# EAGLE schematic PQ60 EPS FV3 (EAGLE 7.4.0)
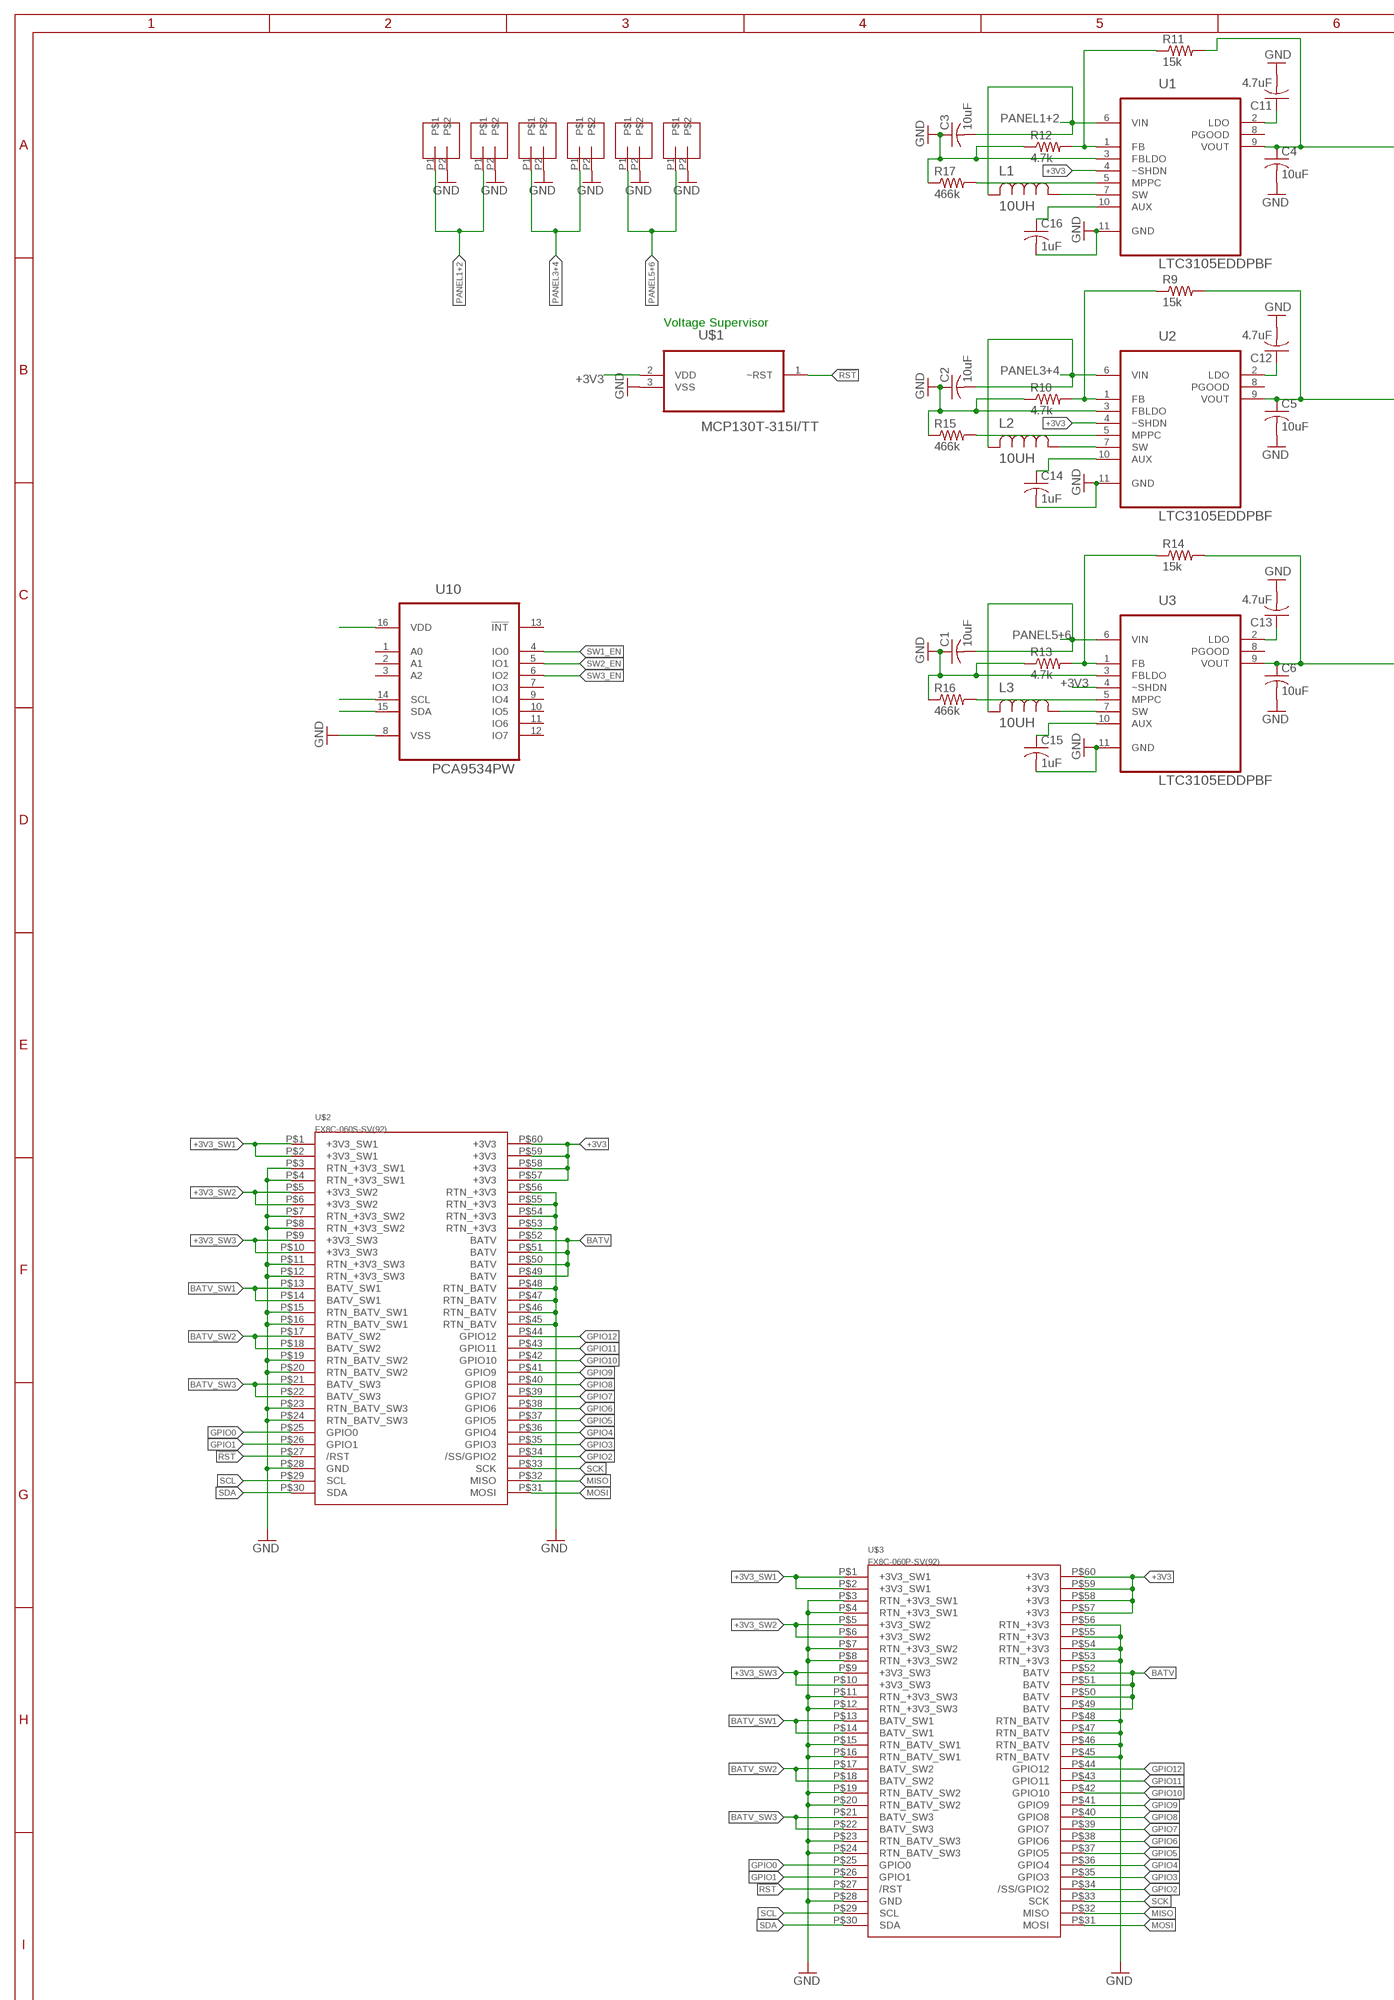
[diagram p0: schematic, sheet 1, part 1 of 2]
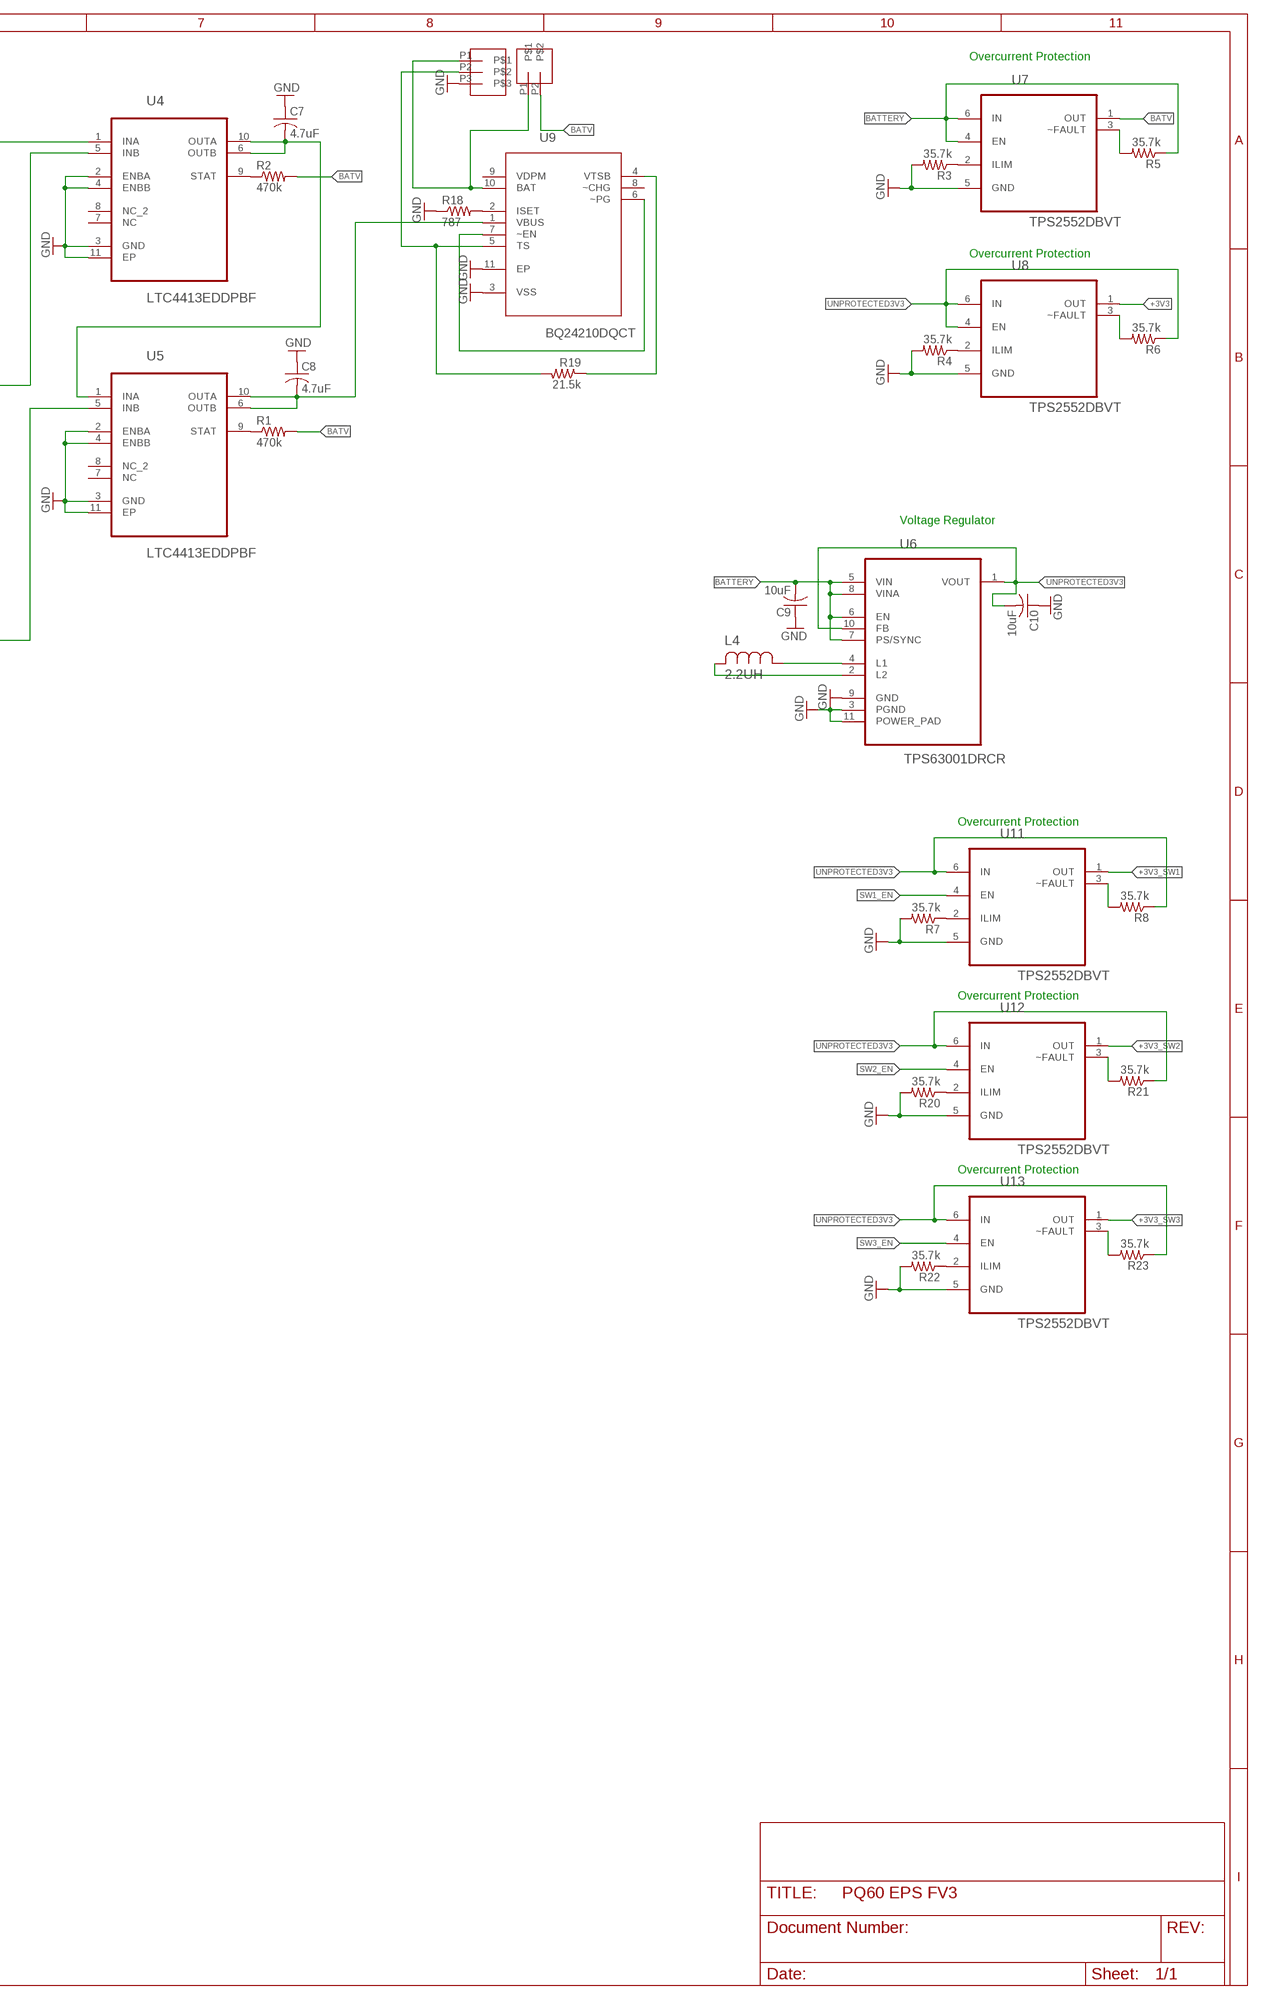
[diagram p1: schematic, sheet 1, part 2 of 2]

## Parts
C1  10uF  C-USC0805  [C0805]
C2  10uF  C-USC0805  [C0805]
C3  10uF  C-USC0805  [C0805]
C4  10uF  C-USC0805  [C0805]
C5  10uF  C-USC0805  [C0805]
C6  10uF  C-USC0805  [C0805]
C7  4.7uF  C-USC0805  [C0805]
C8  4.7uF  C-USC0805  [C0805]
C9  10uF  C-USC0805  [C0805]
C10  10uF  C-USC0805  [C0805]
C11  4.7uF  C-USC0805  [C0805]
C12  4.7uF  C-USC0805  [C0805]
C13  4.7uF  C-USC0805  [C0805]
C14  1uF  C-USC0805  [C0805]
C15  1uF  C-USC0805  [C0805]
C16  1uF  C-USC0805  [C0805]
L1  10UH  ELL6SH100M-6XH  [IND_ELL6XH]
L2  10UH  ELL6SH100M-6XH  [IND_ELL6XH]
L3  10UH  ELL6SH100M-6XH  [IND_ELL6XH]
L4  2.2UH  ELL3FU2R2N-3FU  [IND_ELL3FU]
R1  470k  R-US_R0805  [R0805]
R2  470k  R-US_R0805  [R0805]
R3  35.7k  R-US_R0805  [R0805]
R4  35.7k  R-US_R0805  [R0805]
R5  35.7k  R-US_R0805  [R0805]
R6  35.7k  R-US_R0805  [R0805]
R7  35.7k  R-US_R0805  [R0805]
R8  35.7k  R-US_R0805  [R0805]
R9  15k  R-US_R0805  [R0805]
R10  4.7k  R-US_R0805  [R0805]
R11  15k  R-US_R0805  [R0805]
R12  4.7k  R-US_R0805  [R0805]
R13  4.7k  R-US_R0805  [R0805]
R14  15k  R-US_R0805  [R0805]
R15  466k  R-US_R0805  [R0805]
R16  466k  R-US_R0805  [R0805]
R17  466k  R-US_R0805  [R0805]
R18  787  R-US_R0805  [R0805]
R19  21.5k  R-US_R0805  [R0805]
R20  35.7k  R-US_R0805  [R0805]
R21  35.7k  R-US_R0805  [R0805]
R22  35.7k  R-US_R0805  [R0805]
R23  35.7k  R-US_R0805  [R0805]
U1  LTC3105EDDPBF  [DFN300X300X80-11N]
U2  LTC3105EDDPBF  [DFN300X300X80-11N]
U3  LTC3105EDDPBF  [DFN300X300X80-11N]
U4  LTC4413EDDPBF  [DFN300X300X80-11N]
U5  LTC4413EDDPBF  [DFN300X300X80-11N]
U6  TPS63001DRCR  [SON50P300X300X100-11N]
U7  TPS2552DBVT  [SOT95P280X145-6N]
U8  TPS2552DBVT  [SOT95P280X145-6N]
U9  BQ24210DQCT  [SON50P200X300X80-11N]
U10  PCA9534PW  [SOP65P640X110-16N]
U11  TPS2552DBVT  [SOT95P280X145-6N]
U12  TPS2552DBVT  [SOT95P280X145-6N]
U13  TPS2552DBVT  [SOT95P280X145-6N]
U$1  MCP130T-315I/TT  [SOT95P237X112-3N]
U$2  FX8C-060S-SV(92)  [FX8C-060S-SV(92)]
U$3  FX8C-060P-SV(92)  [FX8C-060P-SV(92)]
U$4  JST-SH-02  [JST-SH-02]
U$5  JST-SH-02  [JST-SH-02]
U$6  JST-SH-02  [JST-SH-02]
U$7  JST-SH-02  [JST-SH-02]
U$8  JST-SH-02  [JST-SH-02]
U$9  JST-SH-02  [JST-SH-02]
U$10  JST-SH-02  [JST-SH-02]
U$11  JST-SH-03  [JST-SH-03]

## Nets
!RST: U$1.1(~RST) U$2.P$27(/RST) U$3.P$27(/RST)
+3V3: U1.4(~SHDN) U2.4(~SHDN) U3.4(~SHDN) U8.1(OUT) U10.16(VDD) U$1.2(VDD) U$2.P$57(+3V3) U$2.P$58(+3V3) U$2.P$59(+3V3) U$2.P$60(+3V3) U$3.P$57(+3V3) U$3.P$58(+3V3) U$3.P$59(+3V3) U$3.P$60(+3V3)
+3V3_SW1: U11.1(OUT) U$2.P$1(+3V3_SW1) U$2.P$2(+3V3_SW1) U$3.P$1(+3V3_SW1) U$3.P$2(+3V3_SW1)
+3V3_SW2: U12.1(OUT) U$2.P$5(+3V3_SW2) U$2.P$6(+3V3_SW2) U$3.P$5(+3V3_SW2) U$3.P$6(+3V3_SW2)
+3V3_SW3: U13.1(OUT) U$2.P$9(+3V3_SW3) U$2.P$10(+3V3_SW3) U$3.P$9(+3V3_SW3) U$3.P$10(+3V3_SW3)
BATTERY: C9.2 R5.1 U6.5(VIN) U6.6(EN) U6.7(PS/SYNC) U6.8(VINA) U7.4(EN) U7.6(IN)
BATV: R1.2 R2.2 U7.1(OUT) U$2.P$49(BATV) U$2.P$50(BATV) U$2.P$51(BATV) U$2.P$52(BATV) U$3.P$49(BATV) U$3.P$50(BATV) U$3.P$51(BATV) U$3.P$52(BATV) U$10.P2
BATV_SW1: U$2.P$13(BATV_SW1) U$2.P$14(BATV_SW1) U$3.P$13(BATV_SW1) U$3.P$14(BATV_SW1)
BATV_SW2: U$2.P$17(BATV_SW2) U$2.P$18(BATV_SW2) U$3.P$17(BATV_SW2) U$3.P$18(BATV_SW2)
BATV_SW3: U$2.P$21(BATV_SW3) U$2.P$22(BATV_SW3) U$3.P$21(BATV_SW3) U$3.P$22(BATV_SW3)
GND: C1.1 C2.1 C3.1 C4.2 C5.2 C6.2 C7.1 C8.1 C9.1 C10.1 C11.2 C12.2 C13.2 C14.2 C15.2 C16.2 R3.2 R4.2 R7.2 R10.1 R12.1 R13.1 R15.1 R16.1 R17.1 R18.1 R20.2 R22.2 U1.3(FBLDO) U1.11(GND) U2.3(FBLDO) U2.11(GND) U3.3(FBLDO) U3.11(GND) U4.2(ENBA) U4.3(GND) U4.4(ENBB) U4.11(EP) U5.2(ENBA) U5.3(GND) U5.4(ENBB) U5.11(EP) U6.3(PGND) U6.9(GND) U6.11(POWER_PAD) U7.5(GND) U8.5(GND) U9.3(VSS) U9.11(EP) U10.8(VSS) U11.5(GND) U12.5(GND) U13.5(GND) U$1.3(VSS) U$2.P$3(RTN_+3V3_SW1) U$2.P$4(RTN_+3V3_SW1) U$2.P$7(RTN_+3V3_SW2) U$2.P$8(RTN_+3V3_SW2) U$2.P$11(RTN_+3V3_SW3) U$2.P$12(RTN_+3V3_SW3) U$2.P$15(RTN_BATV_SW1) U$2.P$16(RTN_BATV_SW1) U$2.P$19(RTN_BATV_SW2) U$2.P$20(RTN_BATV_SW2) U$2.P$23(RTN_BATV_SW3) U$2.P$24(RTN_BATV_SW3) U$2.P$28(GND) U$2.P$45(RTN_BATV) U$2.P$46(RTN_BATV) U$2.P$47(RTN_BATV) U$2.P$48(RTN_BATV) U$2.P$53(RTN_+3V3) U$2.P$54(RTN_+3V3) U$2.P$55(RTN_+3V3) U$2.P$56(RTN_+3V3) U$3.P$3(RTN_+3V3_SW1) U$3.P$4(RTN_+3V3_SW1) U$3.P$7(RTN_+3V3_SW2) U$3.P$8(RTN_+3V3_SW2) U$3.P$11(RTN_+3V3_SW3) U$3.P$12(RTN_+3V3_SW3) U$3.P$15(RTN_BATV_SW1) U$3.P$16(RTN_BATV_SW1) U$3.P$19(RTN_BATV_SW2) U$3.P$20(RTN_BATV_SW2) U$3.P$23(RTN_BATV_SW3) U$3.P$24(RTN_BATV_SW3) U$3.P$28(GND) U$3.P$45(RTN_BATV) U$3.P$46(RTN_BATV) U$3.P$47(RTN_BATV) U$3.P$48(RTN_BATV) U$3.P$53(RTN_+3V3) U$3.P$54(RTN_+3V3) U$3.P$55(RTN_+3V3) U$3.P$56(RTN_+3V3) U$4.P2 U$5.P2 U$6.P2 U$7.P2 U$8.P2 U$9.P2 U$11.P3
GPIO0: U$2.P$25(GPIO0) U$3.P$25(GPIO0)
GPIO1: U$2.P$26(GPIO1) U$3.P$26(GPIO1)
GPIO2: U$2.P$34(/SS/GPIO2) U$3.P$34(/SS/GPIO2)
GPIO3: U$2.P$35(GPIO3) U$3.P$35(GPIO3)
GPIO4: U$2.P$36(GPIO4) U$3.P$36(GPIO4)
GPIO5: U$2.P$37(GPIO5) U$3.P$37(GPIO5)
GPIO6: U$2.P$38(GPIO6) U$3.P$38(GPIO6)
GPIO7: U$2.P$39(GPIO7) U$3.P$39(GPIO7)
GPIO8: U$2.P$40(GPIO8) U$3.P$40(GPIO8)
GPIO9: U$2.P$41(GPIO9) U$3.P$41(GPIO9)
GPIO10: U$2.P$42(GPIO10) U$3.P$42(GPIO10)
GPIO11: U$2.P$43(GPIO11) U$3.P$43(GPIO11)
GPIO12: U$2.P$44(GPIO12) U$3.P$44(GPIO12)
MISO: U$2.P$32(MISO) U$3.P$32(MISO)
MOSI: U$2.P$31(MOSI) U$3.P$31(MOSI)
N$1: L2.1 U2.7(SW)
N$2: L3.1 U3.7(SW)
N$3: L1.1 U1.7(SW)
N$4: L4.1 U6.4(L1)
N$5: C4.1 R11.2 U1.9(VOUT) U4.1(INA)
N$6: C5.1 R9.2 U2.9(VOUT) U4.5(INB)
N$7: C6.1 R14.2 U3.9(VOUT) U5.5(INB)
N$8: R4.1 U8.2(ILIM)
N$9: C7.2 U4.6(OUTB) U4.10(OUTA) U5.1(INA)
N$10: R1.1 U5.9(STAT)
N$11: R2.1 U4.9(STAT)
N$12: L4.2 U6.2(L2)
N$13: R3.1 U7.2(ILIM)
N$14: R5.2 U7.3(~FAULT)
N$15: R6.2 U8.3(~FAULT)
N$16: R7.1 U11.2(ILIM)
N$17: R8.2 U11.3(~FAULT)
N$18: R13.2 R14.1 U3.1(FB)
N$19: C11.1 U1.2(LDO)
N$20: C12.1 U2.2(LDO)
N$21: C13.1 U3.2(LDO)
N$22: C14.1 U2.10(AUX)
N$23: C15.1 U3.10(AUX)
N$24: C16.1 U1.10(AUX)
N$25: R11.1 R12.2 U1.1(FB)
N$26: R9.1 R10.2 U2.1(FB)
N$28: R15.2 U2.5(MPPC)
N$29: R16.2 U3.5(MPPC)
N$30: R17.2 U1.5(MPPC)
N$31: C8.2 U5.6(OUTB) U5.10(OUTA) U9.1(VBUS)
N$32: U9.6(~PG) U9.7(~EN)
N$33: R18.2 U9.2(ISET)
N$34: U9.10(BAT) U$10.P1 U$11.P1
N$35: R19.2 U9.5(TS) U$11.P2
N$36: R19.1 U9.4(VTSB)
N$38: R20.1 U12.2(ILIM)
N$39: R21.2 U12.3(~FAULT)
N$40: R22.1 U13.2(ILIM)
N$41: R23.2 U13.3(~FAULT)
PANEL1+2: C3.2 L1.2 U1.6(VIN) U$4.P1 U$5.P1
PANEL3+4: C2.2 L2.2 U2.6(VIN) U$6.P1 U$7.P1
PANEL5+6: C1.2 L3.2 U3.6(VIN) U$8.P1 U$9.P1
SCK: U$2.P$33(SCK) U$3.P$33(SCK)
SCL: U10.14(SCL) U$2.P$29(SCL) U$3.P$29(SCL)
SDA: U10.15(SDA) U$2.P$30(SDA) U$3.P$30(SDA)
SW1_EN: U10.4(IO0) U11.4(EN)
SW2_EN: U10.5(IO1) U12.4(EN)
SW3_EN: U10.6(IO2) U13.4(EN)
UNPROTECTED3V3: C10.2 R6.1 R8.1 R21.1 R23.1 U6.1(VOUT) U6.10(FB) U8.4(EN) U8.6(IN) U11.6(IN) U12.6(IN) U13.6(IN)
Unconnected: U1.8(PGOOD) U2.8(PGOOD) U3.8(PGOOD) U4.7(NC) U4.8(NC_2) U5.7(NC) U5.8(NC_2) U9.8(~CHG) U9.9(VDPM) U10.1(A0) U10.2(A1) U10.3(A2) U10.7(IO3) U10.9(IO4) U10.10(IO5) U10.11(IO6) U10.12(IO7) U10.13(!INT)

## Notes on the sheet
- Overcurrent Protection
- Overcurrent Protection
- Voltage Supervisor
- Voltage Regulator
- Overcurrent Protection
- Overcurrent Protection
- Overcurrent Protection

## Library data of the parts
C1-C16 = adafruit:C-US: CAPACITOR, American symbol
L1-L3 = Panasonic-ELL:ELL: Choke Coils; MPN: ELL6SH100M; OC_FARNELL: 1539555; OC_NEWARK: 95M4201; PACKAGE: SMD; SUPPLIER: PANASONIC
L4 = Panasonic-ELL:ELL: Choke Coils; CURRENTRATING: 1.6A; MPN: ELL3FU2R2N; OC_FARNELL: 1888686; OC_NEWARK: 56T0899; PACKAGE: SMD-3FU; SUPPLIER: PANASONIC; TOLERANCE: ±30 %
R1-R23 = adafruit:R-US_: RESISTOR, American symbol
U1-U3 = LTC3105:LTC3105EDDPBF: 400mA Step-Up DC/DC Converter with Maximum Power Point Control and 250mV Start-Up; MPN: LTC3105EDD#PBF; OC_FARNELL: 1898600; OC_NEWARK: 27T5809; PACKAGE: DFN-10; SUPPLIER: Linear Technology
U4 U5 = LTC4413:LTC4413EDDPBF: Dual 2.6A, 2.5V to 5.5V, Ideal Diodes; MPN: LTC4413EDD#PBF; OC_FARNELL: 1663736; OC_NEWARK: 56M9529; PACKAGE: DFN-10; SUPPLIER: Linear Technology
U6 = TPS63001:TPS63001DRCR: HIGH EFFICIENT SINGLE INDUCTOR BUCK-BOOST CONVERTER WITH 1.8-A SWITCHES; MPN: TPS63001DRCR; OC_FARNELL: -; OC_NEWARK: 85K1711; PACKAGE: SON-10; SUPPLIER: TEXAS INSTRUMENTS
U7 U8 U11-U13 = TPS2552:TPS2552DBVT: PRECISION ADJUSTABLE CURRENT-LIMITED POWER-DISTRIBUTION SWITCHES; MPN: TPS2552DBVT; OC_FARNELL: 1694421; OC_NEWARK: 40P3866; PACKAGE: SOT-23-6; SUPPLIER: Texas Instruments
U9 = BQ24210:BQ24210DQCT: Single Cell Li-Ion Battery Solar Charger; MPN: BQ24210DQCT; OC_FARNELL: 1903633; OC_NEWARK: 56T0491; PACKAGE: SON-10; SUPPLIER: TEXAS INSTRUMENTS
U10 = PCA9534PW:PCA9534PW: IC, IO PORT, I2C/SMBUS 8BIT, 16TSSOP; MPN: PCA9534PW; OC_FARNELL: 2212090; OC_NEWARK: 55W4311; PACKAGE: TSSOP16; SUPPLIER: NXP
U$1 = MCP130T:MCP130T-315I/TT: Microcontroller Supervisory Circuit; MPN: MCP130T-315I/TT; OC_FARNELL: 3021154; OC_NEWARK: 96K3703; PACKAGE: SOT-3; SUPPLIER: Microchip
U$2 = PQ60:FX8C-060S-SV(92)
U$3 = PQ60:FX8C-060P-SV(92)
U$4-U$10 = JST SH 02:JST-SH-02
U$11 = JST SH 03:JST-SH-03

## Net classes
0 default: clearance 0.205 mm